# Altium schematic sheet Arduino_STM32F4xxVE.SchDoc: Arduino 2560 circuit
size A3; ApprovedBy: Eli; CheckedBy: Eli; DrawnBy: Eli; Engineer: Eli; Organization: 富源盛电子科技有限公司; Address1: 深圳市龙华新区; Address2: 观澜街道科利邦工业园; Address3: B栋（宿舍楼）15楼; Address4: T: 159 8944 7740; DocumentNumber: 1; Revision: 1.0; SheetNumber: 1; SheetTotal: 8; Status: Final
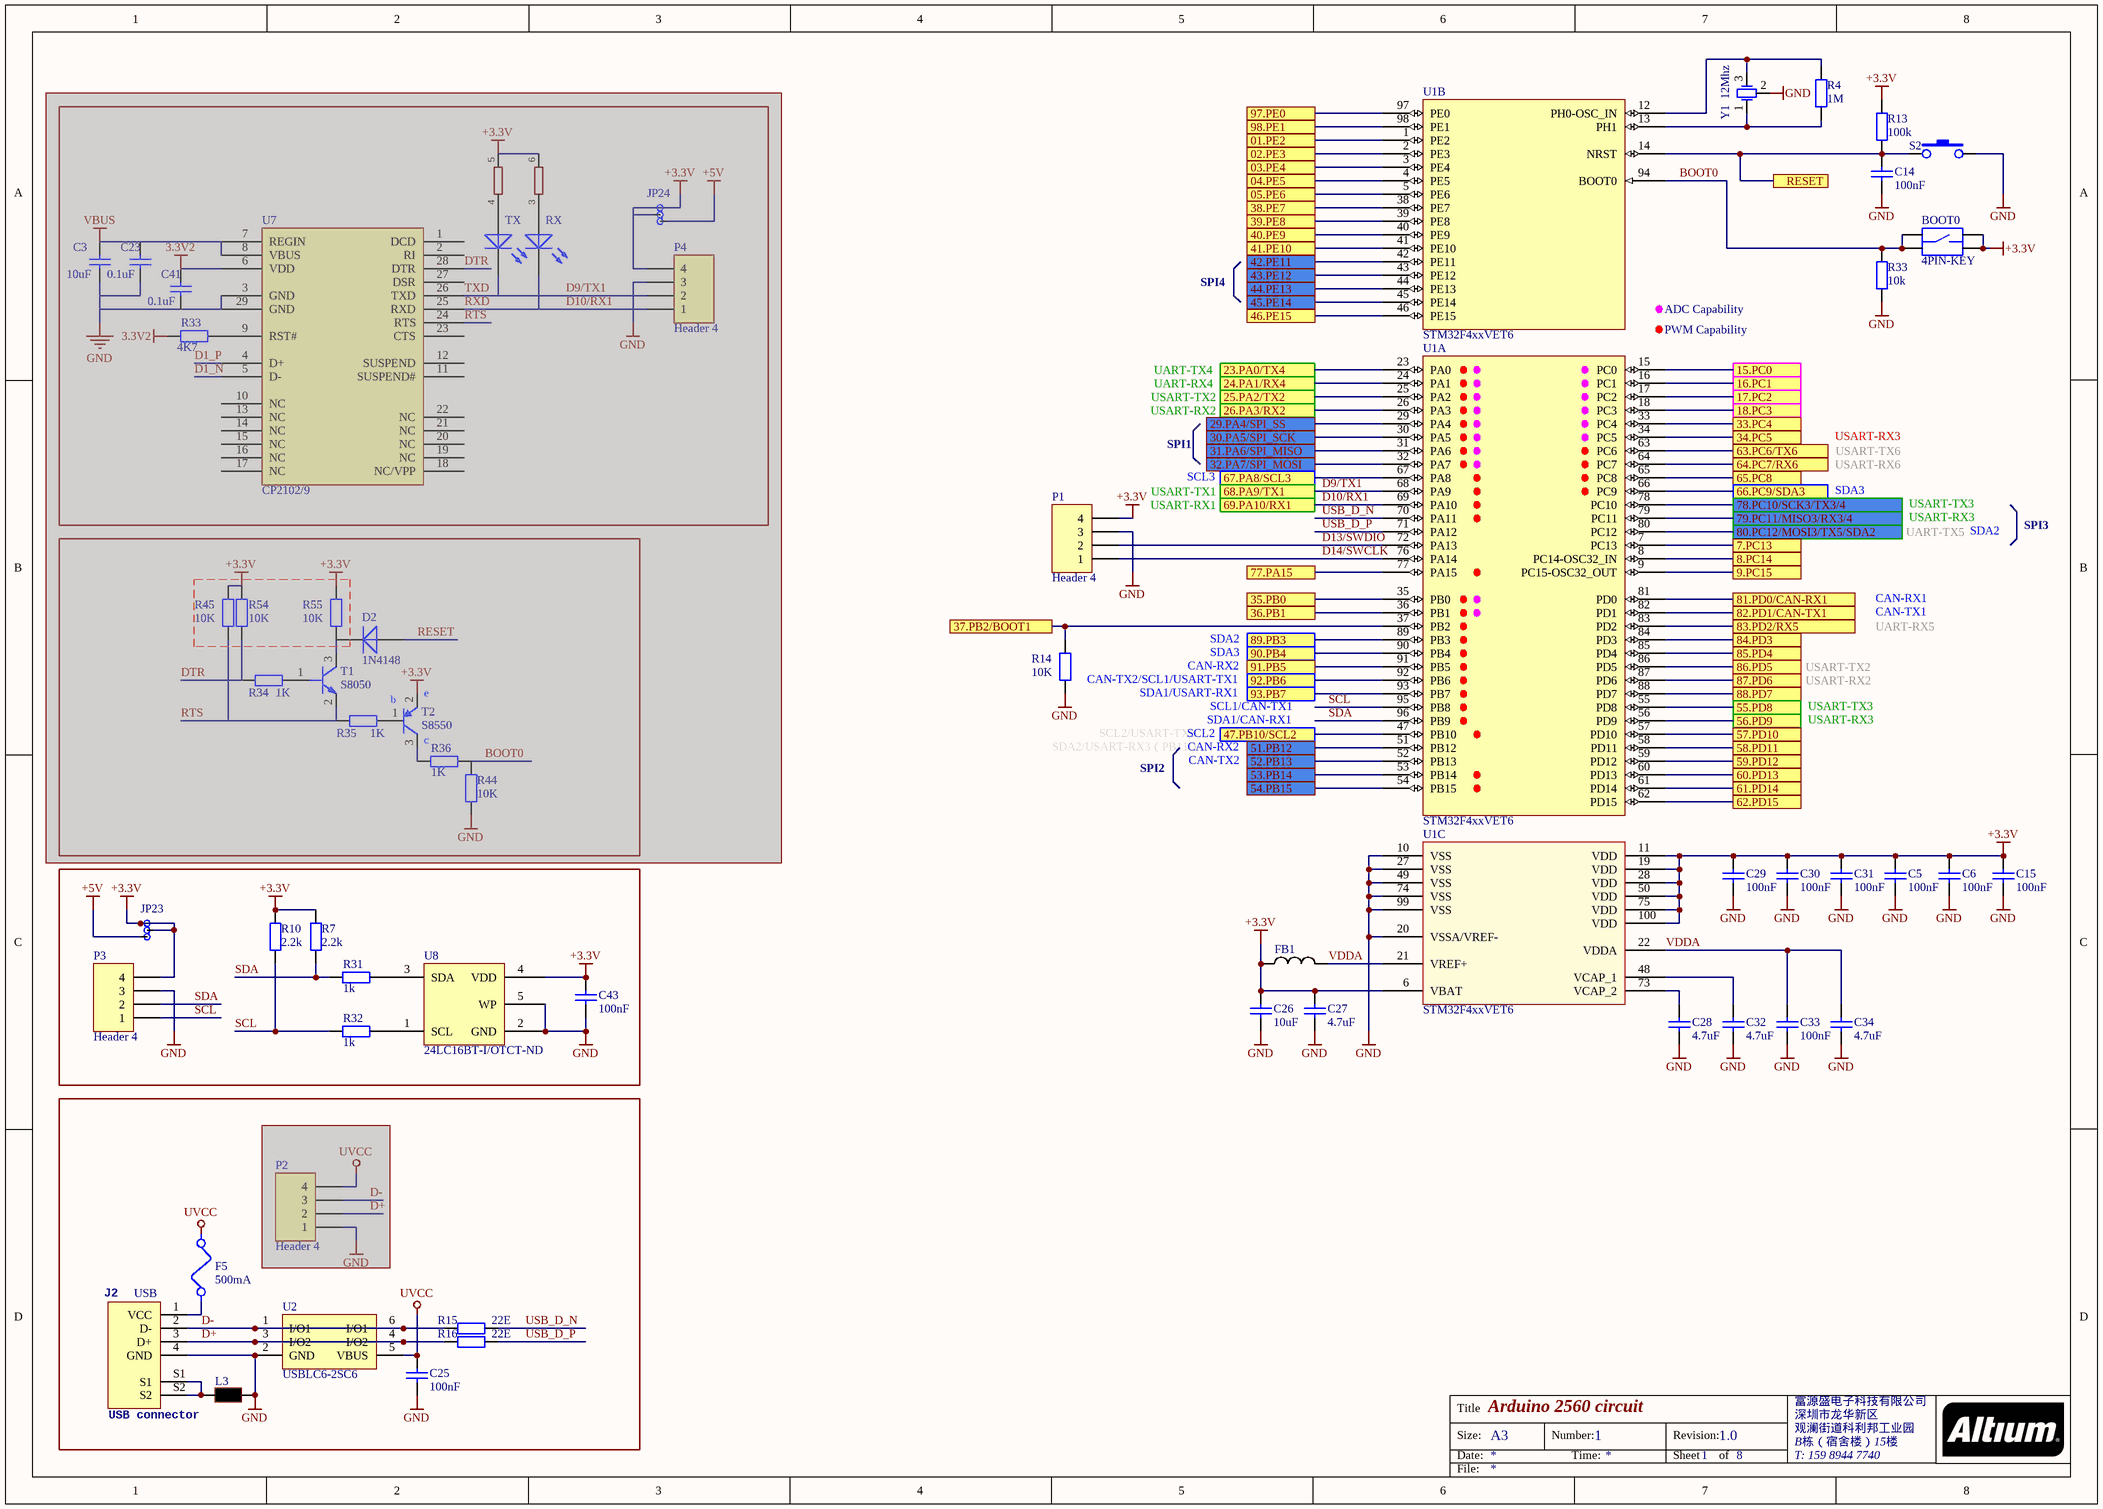
[diagram p0: Arduino_STM32F4xxVE.SchDoc]

## Parts
(Parts that share a designator on the sheet are numbered #1, #2 ... from top to bottom, then left to right.)
BOOT0  4PIN-KEY  [5X5 贴片按键]
C3  value 10uF  [C-0603]  (hidden comment: Cap)  (masked out: inside a compile mask, not in the netlist)
C5  100nF  [CAP0402]
C6  100nF  [CAP0402]
C14  100nF  [CAP0402]
C15  100nF  [CAP0402]
C23  value 0.1uF  [C-0603]  (hidden comment: Cap)  (masked out: inside a compile mask, not in the netlist)
C25  100nF  [CAP0603]
C26  10uF  [CAP0402]
C27  4.7uF  [CAP0402]
C28  4.7uF  [CAP0402]
C29  100nF  [CAP0402]
C30  100nF  [CAP0402]
C31  100nF  [CAP0402]
C32  4.7uF  [CAP0402]
C33  100nF  [CAP0402]
C34  4.7uF  [CAP0402]
C41  value 0.1uF  [C-0603]  (hidden comment: Cap)  (masked out: inside a compile mask, not in the netlist)
C43  100nF  [CAP0402]
D2  1N4148  [SOD323]  (masked out: inside a compile mask, not in the netlist)
F5  500mA  [RES0805]
FB1  120R @ 100MHz 2A 0603  [L0603]  (value not drawn)
J2  USB connector  [CON-BERG_PN61729-S]
JP23  Jumper-3P  [PAD-JUMPER-3-2OF3_NC_BY_PASTE_YES_SILK_FULL_BOX]  (value not drawn)
JP24  Jumper-3P  [PAD-JUMPER-3-2OF3_NC_BY_PASTE_YES_SILK_FULL_BOX]  (value not drawn)  (masked out: inside a compile mask, not in the netlist)
L3  Bead  [L0805]  (value not drawn)
LD5  orange  [LED0805]  (value not drawn)  (masked out: inside a compile mask, not in the netlist)
LD6  orange  [LED0805]  (value not drawn)  (masked out: inside a compile mask, not in the netlist)
P1  Header 4  [Header 1X4]
P2  Header 4  [Header 1X4]  (masked out: inside a compile mask, not in the netlist)
P3  Header 4  [Header 1X4]
P4  Header 4  [Header 1X4]  (masked out: inside a compile mask, not in the netlist)
R4  1M  [RES0603]
R7  2.2k  [RES0402]
R10  2.2k  [RES0402]
R13  100k  [RES0402]
R14  10K  [RES0402]
R15  22E  [RES0402]
R16  22E  [RES0402]
R31  1k  [RES0402]
R32  1k  [RES0402]
R33#1  10k  [RES0402]
R33#2  value 4K7  [0603-1]  (hidden comment: Res2)  (masked out: inside a compile mask, not in the netlist)
R34  1K  [RES0402]  (masked out: inside a compile mask, not in the netlist)
R35  1K  [RES0402]  (masked out: inside a compile mask, not in the netlist)
R36  1K  [RES0402]  (masked out: inside a compile mask, not in the netlist)
R44  10K  [RES0402]  (masked out: inside a compile mask, not in the netlist)
R45  10K  [RES0402]  (masked out: inside a compile mask, not in the netlist)
R54  10K  [RES0402]  (masked out: inside a compile mask, not in the netlist)
R55  10K  [RES0402]  (masked out: inside a compile mask, not in the netlist)
RN3  1K  [RESISTOR-DIL_CAY16]  (value not drawn)  (parts C,D of 4)  (masked out: inside a compile mask, not in the netlist)
S2  Momentary Tactile Button  [7.5x6x6.5 侧按开关]  (value not drawn)
T1  S8050  [SOT523]  (masked out: inside a compile mask, not in the netlist)
T2  S8550  [SOT523]  (masked out: inside a compile mask, not in the netlist)
U1  STM32F4xxVET6  [TSQFP50P1600X1600X120-100N]  (parts A,B,C of 3)
U2  USBLC6-2SC6  [SOT23-6N]
U7  CP2102/9  [QFN28-L]  (masked out: inside a compile mask, not in the netlist)
U8  24LC16BT-I/OTCT-ND  [SOT23-5]  (no BOM)
Y1  12Mhz  [CSTC]

## Blocks framed on the sheet
USB: C25 F5 J2 L3 P2 R15 R16 U2

## Ports
01.PE2, 02.PE3, 03.PE4, 04.PE5, 05.PE6, 7.PC13, 8.PC14, 9.PC15, 15.PC0, 16.PC1, 17.PC2, 18.PC3, 23.PA0/TX4, 24.PA1/RX4, 25.PA2/TX2, 26.PA3/RX2, 29.PA4/SPI_SS, 30.PA5/SPI_SCK, 31.PA6/SPI_MISO, 32.PA7/SPI_MOSI, 33.PC4, 34.PC5, 35.PB0, 36.PB1, 37.PB2/BOOT1, 38.PE7, 39.PE8, 40.PE9, 41.PE10, 42.PE11, 43.PE12, 44.PE13, 45.PE14, 46.PE15, 47.PB10/SCL2, 51.PB12, 52.PB13, 53.PB14, 54.PB15, 55.PD8, 56.PD9, 57.PD10, 58.PD11, 59.PD12, 60.PD13, 61.PD14, 62.PD15, 63.PC6/TX6, 64.PC7/RX6, 65.PC8, 66.PC9/SDA3, 67.PA8/SCL3, 68.PA9/TX1, 69.PA10/RX1, 77.PA15, 78.PC10/SCK3/TX3/4, 79.PC11/MISO3/RX3/4, 80.PC12/MOSI3/TX5/SDA2, 81.PD0/CAN-RX1, 82.PD1/CAN-TX1, 83.PD2/RX5, 84.PD3, 85.PD4, 86.PD5, 87.PD6, 88.PD7, 89.PB3, 90.PB4, 91.PB5, 92.PB6, 93.PB7, 97.PE0, 98.PE1, RESET

## Nets
+3.3V: BOOT0.3 BOOT0.4 C5.2 C6.2 C15.2 C26.2 C27.2 C29.2 C30.2 C31.2 C43.2 FB1.1 JP23.1 JP23.2 P1.4 P3.4 R7.1 R10.1 R13.2 U1.6(VBAT) U1.11(VDD) U1.19(VDD) U1.28(VDD) U1.50(VDD) U1.75(VDD) U1.100(VDD) U8.4(VDD)
+5V: JP23.3
GND: C5.1 C6.1 C14.1 C15.1 C25.1 C26.1 C27.1 C28.1 C29.1 C30.1 C31.1 C32.1 C33.1 C34.1 C43.1 J2.4(GND) L3.2 P1.3 P3.3 R14.1 R33#1.1 S2.2 U1.10(VSS) U1.20(VSSA/VREF-) U1.27(VSS) U1.49(VSS) U1.74(VSS) U1.99(VSS) U2.2(GND) U8.2(GND) U8.5(WP) Y1.2
UVCC: C25.2 F5.2 U2.5(VBUS)
01.PE2: U1.1(PE2) ; port 01.PE2
02.PE3: U1.2(PE3) ; port 02.PE3
03.PE4: U1.3(PE4) ; port 03.PE4
04.PE5: U1.4(PE5) ; port 04.PE5
05.PE6: U1.5(PE6) ; port 05.PE6
7.PC13: U1.7(PC13) ; port 7.PC13
8.PC14: U1.8(PC14-OSC32_IN) ; port 8.PC14
9.PC15: U1.9(PC15-OSC32_OUT) ; port 9.PC15
15.PC0: U1.15(PC0) ; port 15.PC0
16.PC1: U1.16(PC1) ; port 16.PC1
17.PC2: U1.17(PC2) ; port 17.PC2
18.PC3: U1.18(PC3) ; port 18.PC3
23.PA0/TX4: U1.23(PA0) ; port 23.PA0/TX4
24.PA1/RX4: U1.24(PA1) ; port 24.PA1/RX4
25.PA2/TX2: U1.25(PA2) ; port 25.PA2/TX2
26.PA3/RX2: U1.26(PA3) ; port 26.PA3/RX2
29.PA4/SPI_SS: U1.29(PA4) ; port 29.PA4/SPI_SS
30.PA5/SPI_SCK: U1.30(PA5) ; port 30.PA5/SPI_SCK
31.PA6/SPI_MISO: U1.31(PA6) ; port 31.PA6/SPI_MISO
32.PA7/SPI_MOSI: U1.32(PA7) ; port 32.PA7/SPI_MOSI
33.PC4: U1.33(PC4) ; port 33.PC4
34.PC5: U1.34(PC5) ; port 34.PC5
35.PB0: U1.35(PB0) ; port 35.PB0
36.PB1: U1.36(PB1) ; port 36.PB1
37.PB2/BOOT1: R14.2 U1.37(PB2) ; port 37.PB2/BOOT1
38.PE7: U1.38(PE7) ; port 38.PE7
39.PE8: U1.39(PE8) ; port 39.PE8
40.PE9: U1.40(PE9) ; port 40.PE9
41.PE10: U1.41(PE10) ; port 41.PE10
42.PE11: U1.42(PE11) ; port 42.PE11
43.PE12: U1.43(PE12) ; port 43.PE12
44.PE13: U1.44(PE13) ; port 44.PE13
45.PE14: U1.45(PE14) ; port 45.PE14
46.PE15: U1.46(PE15) ; port 46.PE15
47.PB10/SCL2: U1.47(PB10) ; port 47.PB10/SCL2
51.PB12: U1.51(PB12) ; port 51.PB12
52.PB13: U1.52(PB13) ; port 52.PB13
53.PB14: U1.53(PB14) ; port 53.PB14
54.PB15: U1.54(PB15) ; port 54.PB15
55.PD8: U1.55(PD8) ; port 55.PD8
56.PD9: U1.56(PD9) ; port 56.PD9
57.PD10: U1.57(PD10) ; port 57.PD10
58.PD11: U1.58(PD11) ; port 58.PD11
59.PD12: U1.59(PD12) ; port 59.PD12
60.PD13: U1.60(PD13) ; port 60.PD13
61.PD14: U1.61(PD14) ; port 61.PD14
62.PD15: U1.62(PD15) ; port 62.PD15
63.PC6/TX6: U1.63(PC6) ; port 63.PC6/TX6
64.PC7/RX6: U1.64(PC7) ; port 64.PC7/RX6
65.PC8: U1.65(PC8) ; port 65.PC8
66.PC9/SDA3: U1.66(PC9) ; port 66.PC9/SDA3
67.PA8/SCL3: U1.67(PA8) ; port 67.PA8/SCL3
77.PA15: U1.77(PA15) ; port 77.PA15
78.PC10/SCK3/TX3/4: U1.78(PC10) ; port 78.PC10/SCK3/TX3/4
79.PC11/MISO3/RX3/4: U1.79(PC11) ; port 79.PC11/MISO3/RX3/4
80.PC12/MOSI3/TX5/SDA2: U1.80(PC12) ; port 80.PC12/MOSI3/TX5/SDA2
81.PD0/CAN-RX1: U1.81(PD0) ; port 81.PD0/CAN-RX1
82.PD1/CAN-TX1: U1.82(PD1) ; port 82.PD1/CAN-TX1
83.PD2/RX5: U1.83(PD2) ; port 83.PD2/RX5
84.PD3: U1.84(PD3) ; port 84.PD3
85.PD4: U1.85(PD4) ; port 85.PD4
86.PD5: U1.86(PD5) ; port 86.PD5
87.PD6: U1.87(PD6) ; port 87.PD6
88.PD7: U1.88(PD7) ; port 88.PD7
89.PB3: U1.89(PB3) ; port 89.PB3
90.PB4: U1.90(PB4) ; port 90.PB4
91.PB5: U1.91(PB5) ; port 91.PB5
92.PB6: U1.92(PB6) ; port 92.PB6
93.PB7: U1.93(PB7) ; port 93.PB7
97.PE0: U1.97(PE0) ; port 97.PE0
98.PE1: U1.98(PE1) ; port 98.PE1
BOOT0: BOOT0.1 BOOT0.2 R33#1.2 U1.94(BOOT0)
D9/TX1: U1.68(PA9) ; port 68.PA9/TX1
D10/RX1: U1.69(PA10) ; port 69.PA10/RX1
D13/SWDIO: P1.2 U1.72(PA13)
D14/SWCLK: P1.1 U1.76(PA14)
D+: J2.3(D+) R16.1 U2.3(I/O2) U2.4(I/O2)
D-: J2.2(D-) R15.1 U2.1(I/O1) U2.6(I/O1)
RESET: C14.2 R13.1 S2.1 U1.14(NRST) ; port RESET
SCL: P3.1 R10.2 R32.1 U1.95(PB8)
SDA: P3.2 R7.2 R31.1 U1.96(PB9)
USB_D_N: R15.2 U1.70(PA11)
USB_D_P: R16.2 U1.71(PA12)
VDDA: C33.2 C34.2 FB1.2 U1.21(VREF+) U1.22(VDDA)
NetC28_2: C28.2 U1.73(VCAP_2)
NetC32_2: C32.2 U1.48(VCAP_1)
NetF5_1: F5.1 J2.1(VCC)
NetJ2_S1: J2.S1 J2.S2 L3.1
NetR4_1: R4.1 U1.12(PH0-OSC_IN) Y1.3
NetR4_2: R4.2 U1.13(PH1) Y1.1
NetR31_2: R31.2 U8.3(SDA)
NetR32_2: R32.2 U8.1(SCL)

## Notes on the sheet
- (near LD5) TX
- (near LD6) RX
- SPI4
- (near U1) ADC Capability
- UART-TX4
- UART-RX4
- (near U1) PWM Capability
- SPI1
- USART-TX2
- USART-RX2
- USART-TX6
- USART-TX1
- USART-RX1
- USART-RX6
- UART-TX5
- SPI3
- UART-RX5
- (near T2) b
- (near T2) e
- c
- SPI2
- Labels drawn without touching a wire or pin: CAN-RX1, CAN-RX2, CAN-TX1, CAN-TX2, CAN-TX2/SCL1/USART-TX1, SCL1/CAN-TX1, SCL2, SCL2/USART-TX3, SCL3, SDA1/CAN-RX1, SDA1/USART-RX1, SDA2, SDA2/USART-RX3（PB11）, SDA3, USART-RX3, USART-TX3
- Title
- Size:
- Date:
- A3
- Number:
- Time:
- Revision:
- Sheet
- of
- File:

## Library data of the parts
C3 C23 C41 = Cap: Capacitor; Published: 8-Jun-2000; LatestRevisionDate: 17-Jul-2002; LatestRevisionNote: Re-released for DXP Platform.; PackageReference: RAD-0.3; Publisher: Altium Limited; PackageDescription: Radial Cap, Thru-Hole; 2 Leads; 0.3 in Pin Spacing
C5 C6 C15 C25 C29-C31 C33 = Library_CAP-0002: RO X7R 100nF 10% 50V 0603; Faber ItemCode: 45068500; ID: Library_CAP-0002; Value: 100nF
C14 C26-C28 C32 C34 C43 = Library_CAP-0008: RO C0G 22pF 2% 50V  0603; Faber ItemCode: 35321100; ID: Library_CAP-0008
  C14 C43: Value: 100nF
  C26: Value: 10uF
  C27 C28 C32 C34: Value: 4.7uF
D2 = Diode: RO DIODE 1N4148WS-V-GS08 SOT-323  VISHAY; ID: Library_DIO-0002; Faber ItemCode: 36650500; Info: Small Signal Fast Switching Diode; Mfg: VISHAY; Value: 1N4148
F5 = Library_FUSE-0001: RO ZEK MULTI 500MA SMD 1812 MF-MSMF050-2 BOURNS; Faber ItemCode: 35502800; Info: MULTIFUSE, SMD, 0.5A; Value: 0.5A; ID: Library_FUSE-0001; Mfg: BOURNS; Mfg code: MF-MSMF050-2
FB1 = FERRITE_120R-100MHz_0603: FERRITE BEAD 120 OHM 0603 1LN; Manufacturer 1: Murata Electronics North America; Manufacturer Part Number 1: BLM18PG121SN1D; Current: 900mA; DC Resistance (DCR): 172.9 mOhm Max; Frequency - Self Resonant: 23MHz; Frequency - Test: 100kHz; Impedance @ Frequency: 120 Ohm @ 100MHz; Filter Type: Differential Mode - Single; Number of Lines: 1; Ratings: 2 A; 50 mO DC; SCDType: source; Note: Approved sub OK; Current - Saturation: 900mA; Current - Temperature Rise: 900mA; Applications: Power Supplies; Package / Case: 1210 (3225 Metric); Operating Temperature: -40°C ~ 105°C; ComponentLink1URL: http://www.yuden.co.jp/ut/product/pdf/wound02_e.pdf; ComponentLink1Description: http://www.yuden.co.jp/ut/product/pdf/wound02_e.pdf; Supplier 1: Digi-Key; Supplier Part Number 1: 490-1037-1-ND; Current Rating: 2A; Mounting Type: Surface Mount; Height (Max): 0.037" (0.95mm); Size / Dimension: 0.063" L x 0.031" W (1.60mm x 0.80mm); ComponentLink2URL: http://search.murata.co.jp/Ceramy/image/img/PDF/ENG/L0110S0100BLM18P.pdf; ComponentLink2Description: http://search.murata.co.jp/Ceramy/image/img/PDF/ENG/L0110S0100BLM18P.pdf; Value: 120R @ 100 MHz
J2 = CON-BERG_PN61729-S: OC_FARNELL: unknown; OC_NEWARK: unknown
L3 = Library_COIL-0001: RO FERRIET BLM21PG221SN1D  0805; Faber ItemCode: 36571200; ID: Library_COIL-0001; Value: Bead
LD5 LD6 = LED
P1-P4 = Header 4: Header, 4-Pin; LatestRevisionDate: 17-Jul-2002; LatestRevisionNote: Re-released for DXP Platform.; Publisher: Altium Limited
R4 = Library_RES-0003: RO RES 1M0 1% 0,1W 0603; Faber ItemCode: 36059900; ID: Library_RES-0003; Info: Resistor; Value: 1M
R7 R10 R13 R31 R32 R33#1 = Library_RES-0001: RO RES 10k0 1% 0,063W  0603; Faber ItemCode: 36084500; ID: Library_RES-0001; Info: Resistor
  R7 R10: Value: 2.2k
  R13: Value: 100k
  R31 R32: Value: 1k
  R33#1: Value: 10k
R14-R16 R34-R36 R44 R45 R54 R55 = Library_RES-0007: RO RES 22E0 1% 0,063W 0603; Faber ItemCode: 36108300; ID: Library_RES-0007; Info: Resistor
  R14 R44 R45 R54 R55: Value: 10K
  R15 R16: Value: 22E
  R34-R36: Value: 1K
R33#2 = Res2: Resistor; Published: 8-Jun-2000; LatestRevisionDate: 17-Jul-2002; LatestRevisionNote: Re-released for DXP Platform.; PackageReference: AXIAL-0.4; Publisher: Altium Limited; PackageDescription: Axial Device, Thru-Hole; 2 Leads; 0.4 in Pin Spacing
RN3 = RESISTOR-DIL_4R-NCAT16: OC_FARNELL: unknown; OC_NEWARK: unknown
S2 = SW-PB: SWITCH TACTILE SPST-NO 0.05A 12V; Note: Approved sub OK; Supplier 1: Digi-Key; Supplier Part Number 1: 679-2396-1-ND
T1 = Transistor NPN: RO TRANS BC817-25  SOT-23; ID: Library_TRA-0001; Faber ItemCode: 30828000; Info: 45 V, 500 mA NPN general-purpose transistors; Value: S8050
T2 = Transistor PNP: RO TRANS BC807-40  SOT-23; ID: Library_TRA-0002; Faber ItemCode: 30827800; Info: 45 V, 500 mA PNP general-purpose transistors; Value: S8550
U1 = STM32F4xxVET6: Imported; Manufacturer_Part_Number: stm32f4xxv1; Vendor: STMicroelectronics; C: Copyright (C) 2016 Accelerated Designs. All rights reserved; Copyright: Copyright (C) 2016 Accelerated Designs. All rights reserved; RefDes: RefDes; Type: Type; Value: Value
U8 = EEPROM - Serial I2C: IC EEPROM 16K I2C SOT23-5; Note: DNP; Supplier 1: Digi-Key; Supplier Part Number 1: 24LC16BT-I/OTCT-ND
Y1 = XTAL-3: RO KRIS 16MHz CSTCE16M0V53-R0 SMD MURATA; ID: LIBRARY_XTAL-0002; Info: Build in cap; Faber ItemCode: 36925600; Mfg: MURATA; Mfg code: CSTCE16M0V53-R0; Value: 12Mhz